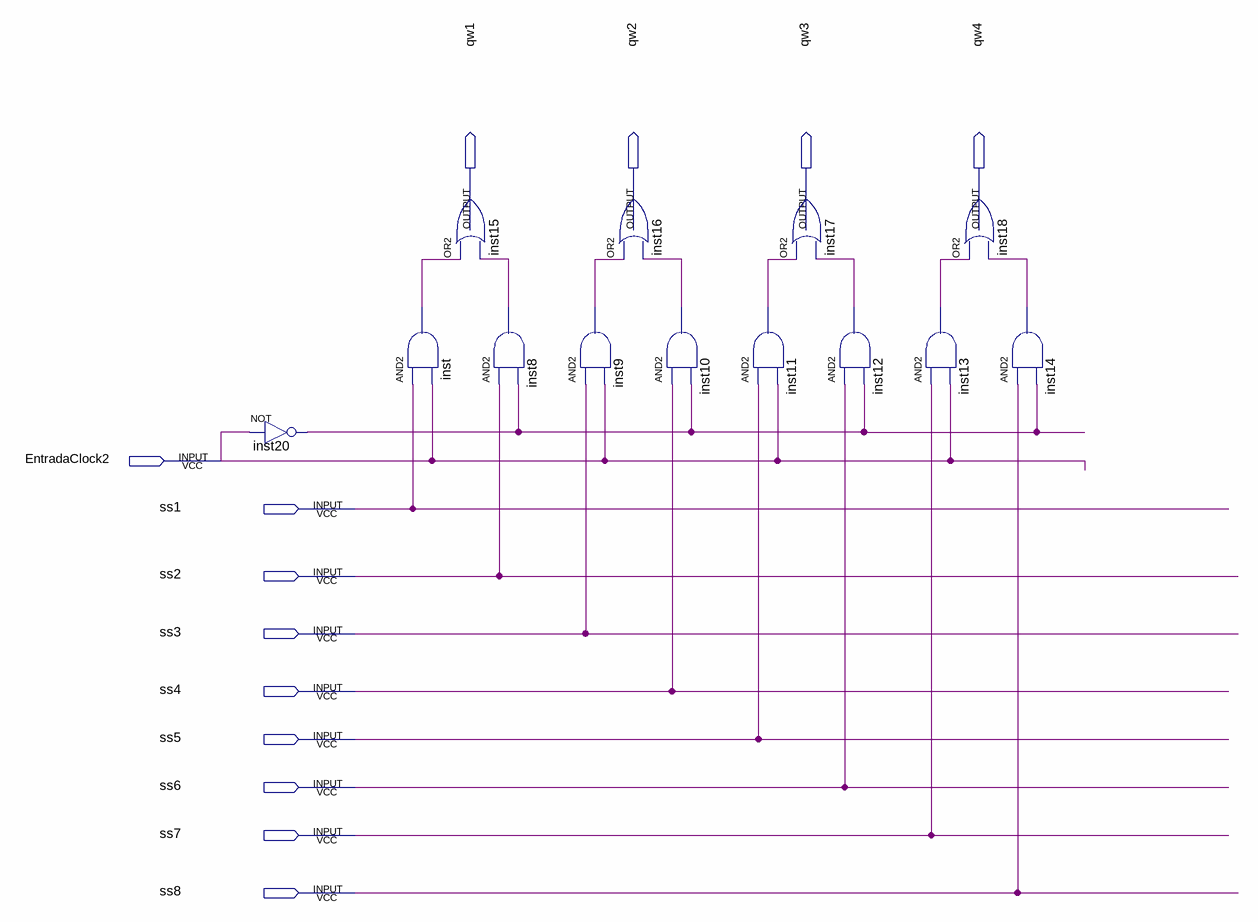
[diagram p0: schematic sheet]
// Quartus schematic mux8x4.bdf as structural Verilog: 13 symbols, 13 pins
module mux8x4 (
  input  EntradaClock2,
  input  ss1,
  input  ss2,
  input  ss3,
  input  ss4,
  input  ss5,
  input  ss6,
  input  ss7,
  input  ss8,
  output qw1,
  output qw2,
  output qw3,
  output qw4
);

  wire inst8_out, inst9_out, inst10_out, inst11_out, inst12_out, inst13_out, inst14_out, inst20_out, inst_out;

  not inst20 (inst20_out, EntradaClock2);
  or inst15 (qw1, inst_out, inst8_out);
  and inst (inst_out, ss1, EntradaClock2);
  and inst8 (inst8_out, ss2, inst20_out);
  or inst16 (qw2, inst9_out, inst10_out);
  and inst9 (inst9_out, ss3, EntradaClock2);
  and inst10 (inst10_out, ss4, inst20_out);
  and inst11 (inst11_out, ss5, EntradaClock2);
  or inst17 (qw3, inst11_out, inst12_out);
  and inst12 (inst12_out, ss6, inst20_out);
  and inst13 (inst13_out, ss7, EntradaClock2);
  or inst18 (qw4, inst13_out, inst14_out);
  and inst14 (inst14_out, ss8, inst20_out);
endmodule
